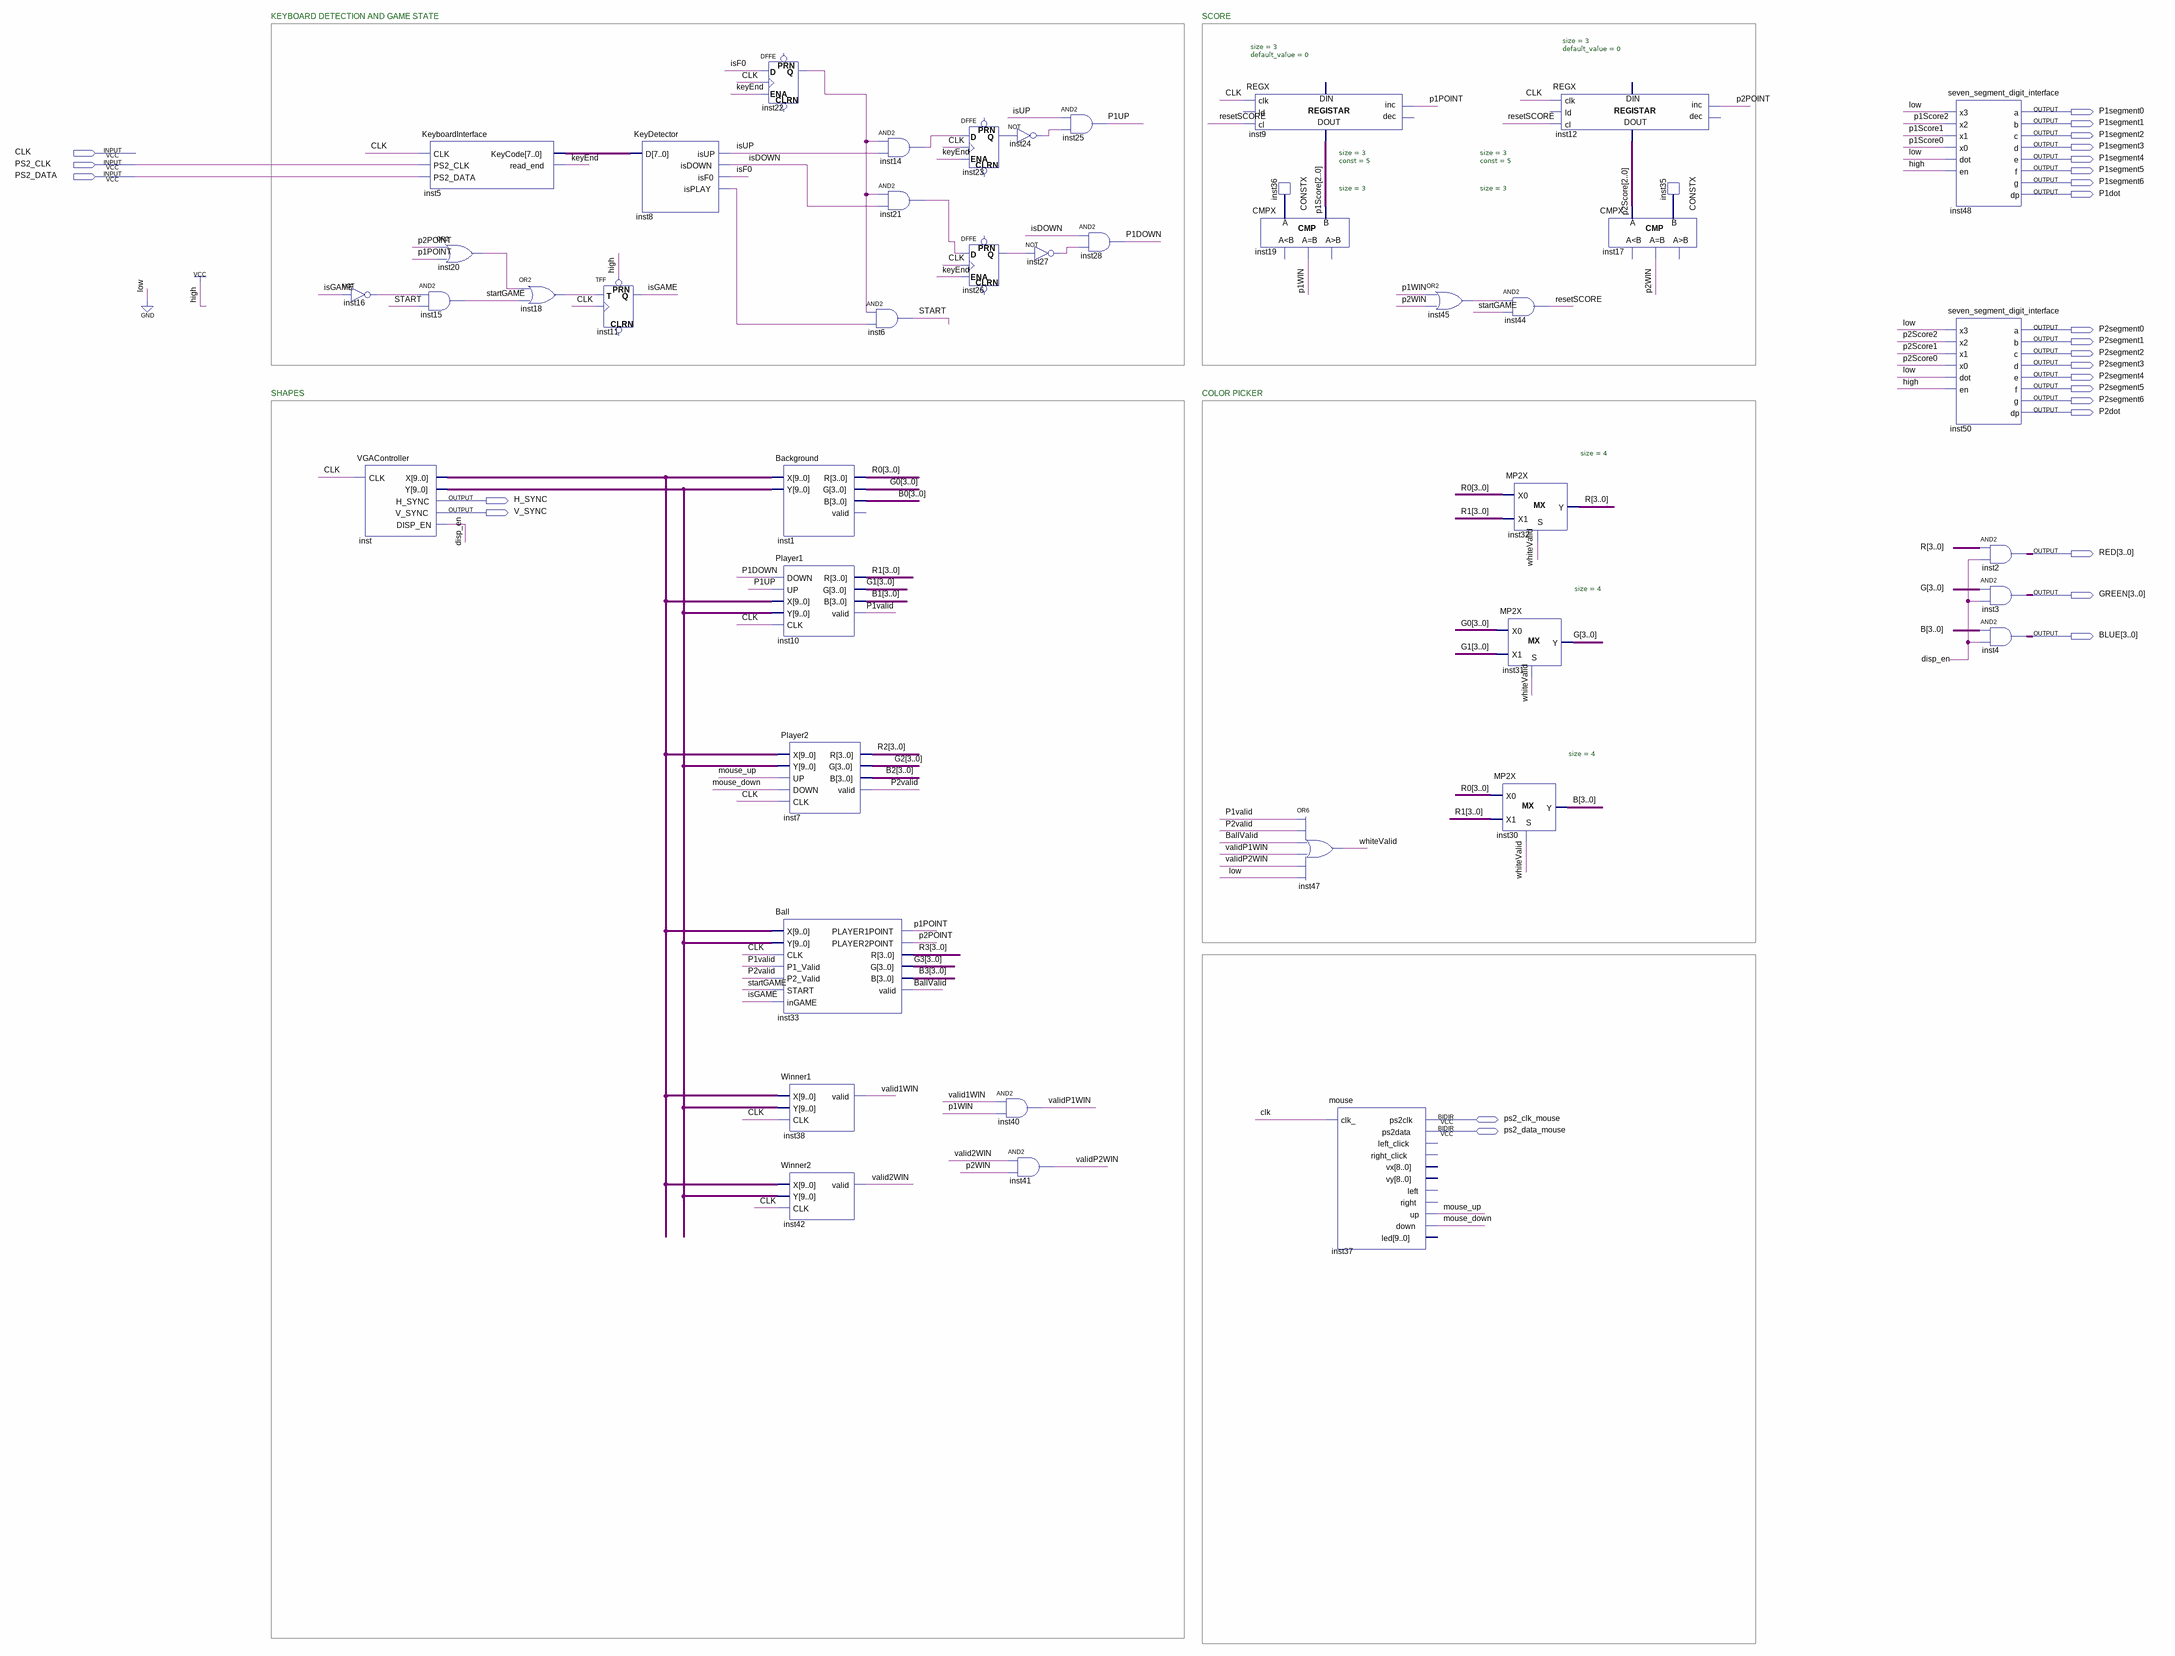
[diagram p0: schematic sheet]
// Quartus schematic Pong.bdf as structural Verilog: 44 symbols, 26 pins
module Pong (
  input  CLK,
  input  PS2_CLK,
  input  PS2_DATA,
  inout  ps2_clk_mouse,
  inout  ps2_data_mouse,
  output P1segment0,
  output P1segment1,
  output P1segment2,
  output P1segment3,
  output P1segment4,
  output P1segment5,
  output P1segment6,
  output P1dot,
  output P2segment0,
  output P2segment1,
  output P2segment2,
  output P2segment3,
  output P2segment4,
  output P2segment5,
  output P2segment6,
  output P2dot,
  output H_SYNC,
  output V_SYNC,
  output [3:0] RED,
  output [3:0] GREEN,
  output [3:0] BLUE
);

  wire BallValid, disp_en, inst8_isplay, inst14_out, inst16_out, inst18_out, inst20_out, inst21_out,
       inst22_q, inst23_q, inst24_out, inst26_q, inst27_out, inst45_out, isDOWN, isF0, isGAME, isUP, keyEnd,
       mouse_down, mouse_up, P1DOWN, p1POINT, P1UP, P1valid, p1WIN, p2POINT, P2valid, p2WIN, resetSCORE,
       START, startGAME, valid1WIN, valid2WIN, validP1WIN, validP2WIN, whiteValid;
  wire [2:0] inst35_data, inst36_data, p1Score, p2Score;
  wire [3:0] B, B0, B1, B2, B3, G, G0, G1, G2, G3, R, R0, R1, R2, R3;
  wire [7:0] inst5_keycode;
  wire [9:0] inst_x, inst_y;

  not inst16 (inst16_out, isGAME);
  VGAController inst (.CLK(CLK), .X(inst_x), .Y(inst_y), .H_SYNC(H_SYNC), .V_SYNC(V_SYNC), .DISP_EN(disp_en));
  KeyboardInterface inst5 (
    .CLK(CLK), .PS2_CLK(PS2_CLK), .PS2_DATA(PS2_DATA), .KeyCode(inst5_keycode), .read_end(keyEnd));
  and inst15 (startGAME, inst16_out, START);
  or inst20 (inst20_out, p2POINT, p1POINT);
  or inst18 (inst18_out, inst20_out, startGAME);
  TFF inst11 (.PRN(1'b1), .T(inst18_out), .CLK(CLK), .Q(isGAME));  // open: CLRN
  KeyDetector inst8 (.D(inst5_keycode), .isUP(isUP), .isDOWN(isDOWN), .isF0(isF0), .isPLAY(inst8_isplay));
  DFFE inst22 (.D(isF0), .CLK(CLK), .ENA(keyEnd), .Q(inst22_q));  // open: PRN, CLRN
  Background inst1 (.X(inst_x), .Y(inst_y), .R(R0), .G(G0), .B(B0));  // open: valid
  Player1 inst10 (.DOWN(P1DOWN), .UP(P1UP), .X(inst_x), .Y(inst_y), .CLK(CLK), .R(R1), .G(G1), .B(B1), .valid(P1valid));
  Player2 inst7 (
    .X(inst_x), .Y(inst_y), .UP(mouse_up), .DOWN(mouse_down), .CLK(CLK), .R(R2), .G(G2), .B(B2),
    .valid(P2valid));
  Ball inst33 (
    .X(inst_x), .Y(inst_y), .CLK(CLK), .P1_Valid(P1valid), .P2_Valid(P2valid), .START(startGAME),
    .inGAME(isGAME), .PLAYER1POINT(p1POINT), .PLAYER2POINT(p2POINT), .R(R3), .G(G3), .B(B3), .valid(BallValid));
  Winner1 inst38 (.X(inst_x), .Y(inst_y), .CLK(CLK), .valid(valid1WIN));
  Winner2 inst42 (.X(inst_x), .Y(inst_y), .CLK(CLK), .valid(valid2WIN));
  and inst14 (inst14_out, inst22_q, isUP);
  and inst21 (inst21_out, inst22_q, isDOWN);
  and inst6 (START, inst22_q, inst8_isplay);
  DFFE inst23 (.D(inst14_out), .CLK(CLK), .ENA(keyEnd), .Q(inst23_q));  // open: PRN, CLRN
  DFFE inst26 (.D(inst21_out), .CLK(CLK), .ENA(keyEnd), .Q(inst26_q));  // open: PRN, CLRN
  not inst24 (inst24_out, inst23_q);
  not inst27 (inst27_out, inst26_q);
  and inst40 (validP1WIN, valid1WIN, p1WIN);
  and inst41 (validP2WIN, valid2WIN, p2WIN);
  and inst25 (P1UP, isUP, inst24_out);
  and inst28 (P1DOWN, isDOWN, inst27_out);
  REGX #(.size(3), .default_value(0)) inst9 (
    .clk(CLK), .cl(resetSCORE), .inc(p1POINT), .data_out(p1Score));  // open: ld, dec, data_in
  CONSTX #(.size(3), .\const (5)) inst36 (.data(inst36_data));
  CMPX #(.size(3)) inst19 (.A(inst36_data), .B(p1Score), .eq(p1WIN));  // open: ls, gr
  or inst47 (whiteValid, P1valid, P2valid, BallValid, validP1WIN, validP2WIN, 1'b0);
  mouse inst37 (
    .clk_(CLK), .up(mouse_up), .down(mouse_down), .ps2clk(ps2_clk_mouse), .ps2data(ps2_data_mouse));  // open: left_click, right_click, vx, vy, left, right, led
  or inst45 (inst45_out, p1WIN, p2WIN);
  and inst44 (resetSCORE, inst45_out, startGAME);
  MP2X #(.size(4)) inst32 (.S(whiteValid), .X0(R0), .X1(R1), .Y(R));
  MP2X #(.size(4)) inst31 (.S(whiteValid), .X0(G0), .X1(G1), .Y(G));
  MP2X #(.size(4)) inst30 (.S(whiteValid), .X0(R0), .X1(R1), .Y(B));
  REGX #(.size(3), .default_value(0)) inst12 (
    .clk(CLK), .cl(resetSCORE), .inc(p2POINT), .data_out(p2Score));  // open: ld, dec, data_in
  CMPX #(.size(3)) inst17 (.A(p2Score), .B(inst35_data), .eq(p2WIN));  // open: ls, gr
  CONSTX #(.size(3), .\const (5)) inst35 (.data(inst35_data));
  seven_segment_digit_interface inst48 (
    .x3(1'b0), .x2(p1Score[2]), .x1(p1Score[1]), .x0(p1Score[0]), .dot(1'b0), .en(1'b1), .a(P1segment0),
    .b(P1segment1), .c(P1segment2), .d(P1segment3), .e(P1segment4), .f(P1segment5), .g(P1segment6), .dp(P1dot));
  seven_segment_digit_interface inst50 (
    .x3(1'b0), .x2(p2Score[2]), .x1(p2Score[1]), .x0(p2Score[0]), .dot(1'b0), .en(1'b1), .a(P2segment0),
    .b(P2segment1), .c(P2segment2), .d(P2segment3), .e(P2segment4), .f(P2segment5), .g(P2segment6), .dp(P2dot));
  assign RED = R & {4{disp_en}};  // AND2 inst2, 4 bits wide
  assign GREEN = G & {4{disp_en}};  // AND2 inst3, 4 bits wide
  assign BLUE = B & {4{disp_en}};  // AND2 inst4, 4 bits wide

  // Notes on the sheet:
  //   KEYBOARD DETECTION AND GAME STATE
  //   SCORE
  //   SHAPES
  //   COLOR PICKER
endmodule
